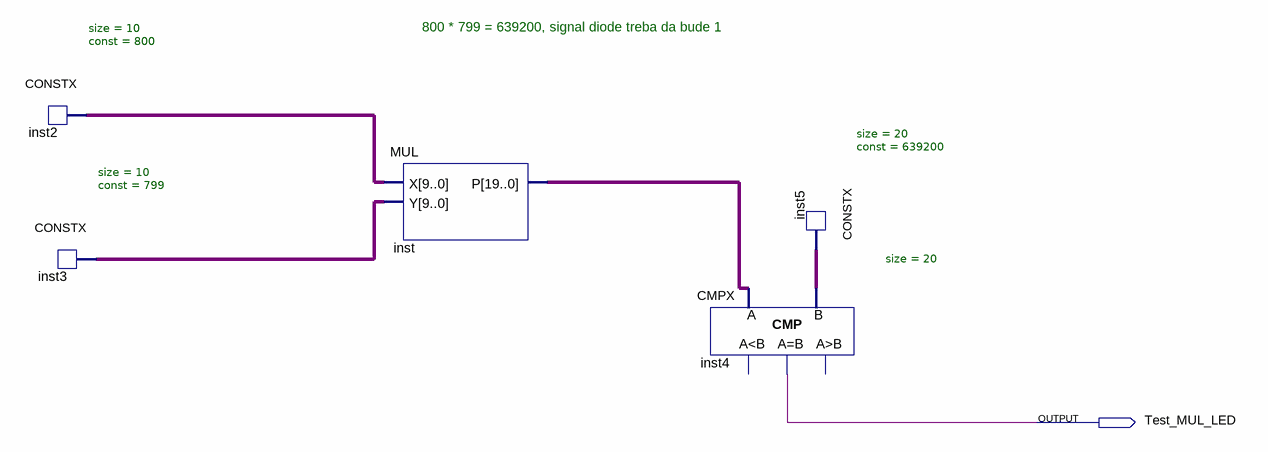
[diagram p0: schematic sheet]
// Quartus schematic Test_MUL.bdf as structural Verilog: 5 symbols, 1 pins
module Test_MUL (
  output Test_MUL_LED
);

  wire [9:0] inst2_data, inst3_data;
  wire [19:0] inst5_data, inst_p;

  CONSTX #(.size(10), .\const (800)) inst2 (.data(inst2_data));
  CONSTX #(.size(10), .\const (799)) inst3 (.data(inst3_data));
  MUL inst (.X(inst2_data), .Y(inst3_data), .P(inst_p));
  CMPX #(.size(20)) inst4 (.A(inst_p), .B(inst5_data), .eq(Test_MUL_LED));  // open: ls, gr
  CONSTX #(.size(20), .\const (639200)) inst5 (.data(inst5_data));

  // Notes on the sheet:
  //   800 * 799 = 639200, signal diode treba da bude 1
endmodule
